# EAGLE design Maze_Project2 (EAGLE 8.7.0)
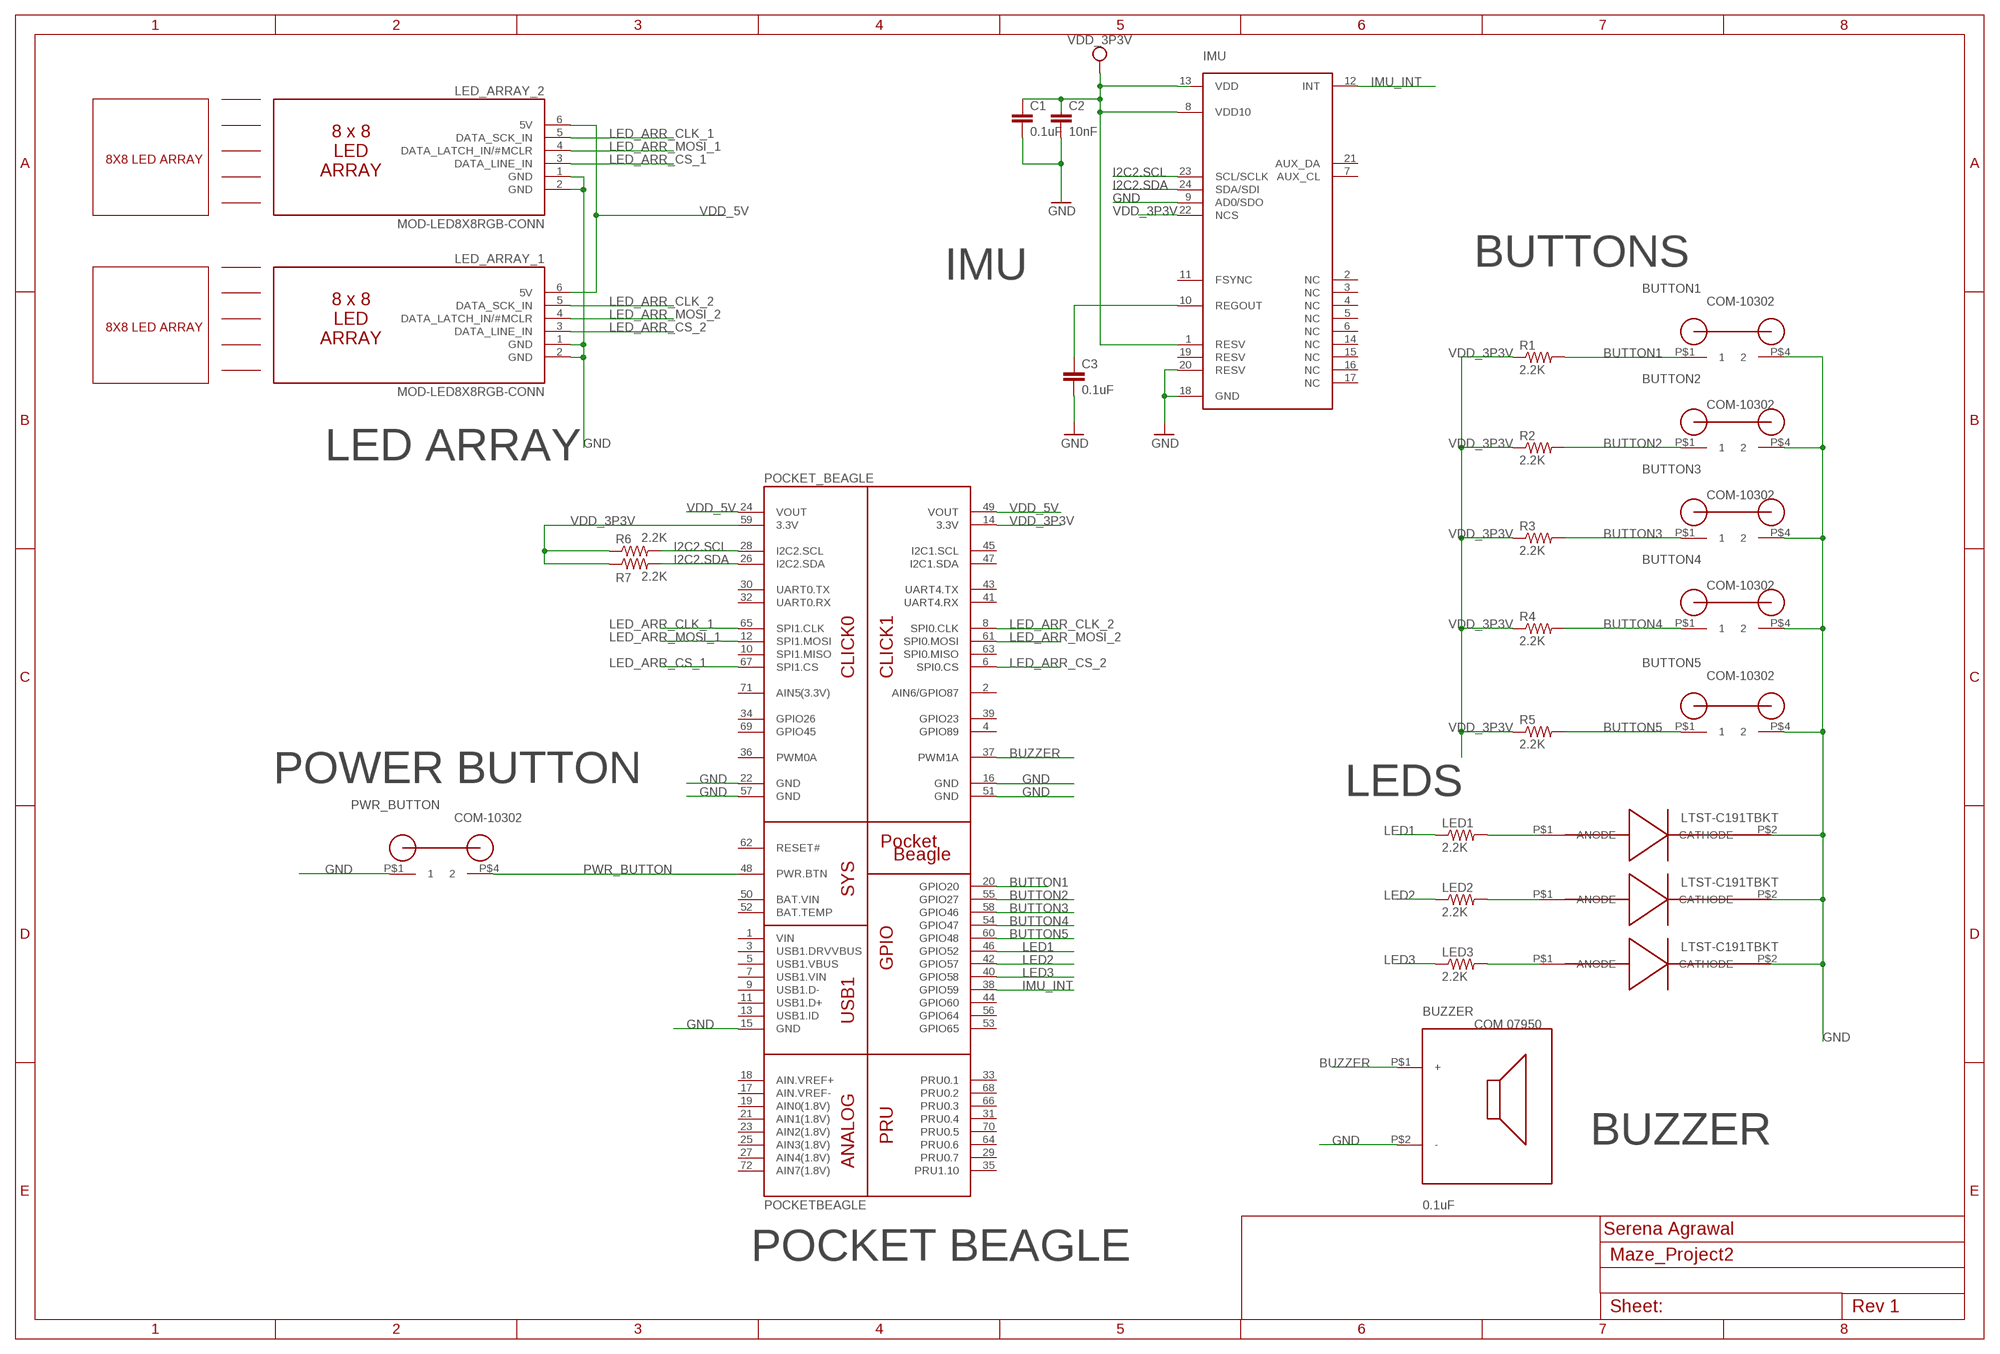
[diagram p0: schematic, sheet 1]

## Parts
BUTTON1  BUTTON  [BUTTON]
BUTTON2  BUTTON  [BUTTON]
BUTTON3  BUTTON  [BUTTON]
BUTTON4  BUTTON  [BUTTON]
BUTTON5  BUTTON  [BUTTON]
BUZZER  0.1uF  BUZZER  [BUZZER]
C1  0.1uF  C_C0402  [C0402]
C2  10nF  C_C0402  [C0402]
C3  0.1uF  C_C0402  [C0402]
IMU  MPU-9250  [QFN-3MMX3MM]
LED1  2.2K  R_R0402  [R0402]
LED2  2.2K  R_R0402  [R0402]
LED3  2.2K  R_R0402  [R0402]
LED_ARRAY_1  MOD-LED8X8RGB-CONN  [FE06W]
LED_ARRAY_2  MOD-LED8X8RGB-CONN  [FE06W]
POCKET_BEAGLE  POCKETBEAGLE  [POCKETBEAGLE]
PWR_BUTTON  BUTTON  [BUTTON]
R1  2.2K  R_R0402  [R0402]
R2  2.2K  R_R0402  [R0402]
R3  2.2K  R_R0402  [R0402]
R4  2.2K  R_R0402  [R0402]
R5  2.2K  R_R0402  [R0402]
R6  2.2K  R_R0402  [R0402]
R7  2.2K  R_R0402  [R0402]
U$7  LED  [LED]
U$8  LED  [LED]
U$9  LED  [LED]

## Nets
B: C3.2 IMU.18(GND) IMU.20(RESV) ; supply symbol labelled GND
BUTTON1: BUTTON1.P$1 POCKET_BEAGLE.20(GPIO20) R1.2
BUTTON2: BUTTON2.P$1 POCKET_BEAGLE.55(GPIO27) R2.2
BUTTON3: BUTTON3.P$1 POCKET_BEAGLE.58(GPIO46) R3.2
BUTTON4: BUTTON4.P$1 POCKET_BEAGLE.54(GPIO47) R4.2
BUTTON5: BUTTON5.P$1 POCKET_BEAGLE.60(GPIO48) R5.2
BUZZER: BUZZER.P$1(+) POCKET_BEAGLE.37(PWM1A)
GND: BUTTON1.P$4 BUTTON2.P$4 BUTTON3.P$4 BUTTON4.P$4 BUTTON5.P$4 BUZZER.P$2(-) IMU.9(AD0/SDO) LED_ARRAY_1.1(GND) LED_ARRAY_1.2(GND) LED_ARRAY_2.1(GND) LED_ARRAY_2.2(GND) POCKET_BEAGLE.15(GND) POCKET_BEAGLE.16(GND) POCKET_BEAGLE.22(GND) POCKET_BEAGLE.51(GND) POCKET_BEAGLE.57(GND) PWR_BUTTON.P$1 U$7.P$2(CATHODE) U$8.P$2(CATHODE) U$9.P$2(CATHODE)
I2C2.SCL: IMU.23(SCL/SCLK) POCKET_BEAGLE.28(I2C2.SCL) R6.2
I2C2.SDA: IMU.24(SDA/SDI) POCKET_BEAGLE.26(I2C2.SDA) R7.2
IMU_INT: IMU.12(INT) POCKET_BEAGLE.38(GPIO59)
LED1: LED1.1 POCKET_BEAGLE.46(GPIO52)
LED2: LED2.1 POCKET_BEAGLE.42(GPIO57)
LED3: LED3.1 POCKET_BEAGLE.40(GPIO58)
LED_ARR_CLK_1: LED_ARRAY_2.5(DATA_SCK_IN) POCKET_BEAGLE.65(SPI1.CLK)
LED_ARR_CLK_2: LED_ARRAY_1.5(DATA_SCK_IN) POCKET_BEAGLE.8(SPI0.CLK)
LED_ARR_CS_1: LED_ARRAY_2.3(DATA_LINE_IN) POCKET_BEAGLE.67(SPI1.CS)
LED_ARR_CS_2: LED_ARRAY_1.3(DATA_LINE_IN) POCKET_BEAGLE.6(SPI0.CS)
LED_ARR_MOSI_1: LED_ARRAY_2.4(DATA_LATCH_IN/#MCLR) POCKET_BEAGLE.12(SPI1.MOSI)
LED_ARR_MOSI_2: LED_ARRAY_1.4(DATA_LATCH_IN/#MCLR) POCKET_BEAGLE.61(SPI0.MOSI)
N$1: C1.2 C2.2 ; supply symbol labelled GND
N$2: C3.1 IMU.10(REGOUT)
N$5: LED1.2 U$7.P$1(ANODE)
N$6: LED2.2 U$8.P$1(ANODE)
N$7: LED3.2 U$9.P$1(ANODE)
PWR_BUTTON: POCKET_BEAGLE.48(PWR.BTN) PWR_BUTTON.P$4
SYS_VDD1_3P3V: C1.1 C2.1 IMU.1(RESV) IMU.8(VDD10) IMU.13(VDD) ; supply symbol labelled VDD_3P3V
VDD_3P3V: IMU.22(NCS) POCKET_BEAGLE.14(3.3V) POCKET_BEAGLE.59(3.3V) R1.1 R2.1 R3.1 R4.1 R5.1 R6.1 R7.1
VDD_5V: LED_ARRAY_1.6(5V) LED_ARRAY_2.6(5V) POCKET_BEAGLE.24(VOUT) POCKET_BEAGLE.49(VOUT)
Unconnected: IMU.2(NC) IMU.3(NC) IMU.4(NC) IMU.5(NC) IMU.6(NC) IMU.7(AUX_CL) IMU.11(FSYNC) IMU.14(NC) IMU.15(NC) IMU.16(NC) IMU.17(NC) IMU.19(RESV) IMU.21(AUX_DA) POCKET_BEAGLE.1(VIN) POCKET_BEAGLE.2(AIN6/GPIO87) POCKET_BEAGLE.3(USB1.DRVVBUS) POCKET_BEAGLE.4(GPIO89) POCKET_BEAGLE.5(USB1.VBUS) POCKET_BEAGLE.7(USB1.VIN) POCKET_BEAGLE.9(USB1.D-) POCKET_BEAGLE.10(SPI1.MISO) POCKET_BEAGLE.11(USB1.D+) POCKET_BEAGLE.13(USB1.ID) POCKET_BEAGLE.17(AIN.VREF-) POCKET_BEAGLE.18(AIN.VREF+) POCKET_BEAGLE.19(AIN0(1.8V)) POCKET_BEAGLE.21(AIN1(1.8V)) POCKET_BEAGLE.23(AIN2(1.8V)) POCKET_BEAGLE.25(AIN3(1.8V)) POCKET_BEAGLE.27(AIN4(1.8V)) POCKET_BEAGLE.29(PRU0.7) POCKET_BEAGLE.30(UART0.TX) POCKET_BEAGLE.31(PRU0.4) POCKET_BEAGLE.32(UART0.RX) POCKET_BEAGLE.33(PRU0.1) POCKET_BEAGLE.34(GPIO26) POCKET_BEAGLE.35(PRU1.10) POCKET_BEAGLE.36(PWM0A) POCKET_BEAGLE.39(GPIO23) POCKET_BEAGLE.41(UART4.RX) POCKET_BEAGLE.43(UART4.TX) POCKET_BEAGLE.44(GPIO60) POCKET_BEAGLE.45(I2C1.SCL) POCKET_BEAGLE.47(I2C1.SDA) POCKET_BEAGLE.50(BAT.VIN) POCKET_BEAGLE.52(BAT.TEMP) POCKET_BEAGLE.53(GPIO65) POCKET_BEAGLE.56(GPIO64) POCKET_BEAGLE.62(RESET#) POCKET_BEAGLE.63(SPI0.MISO) POCKET_BEAGLE.64(PRU0.6) POCKET_BEAGLE.66(PRU0.3) POCKET_BEAGLE.68(PRU0.2) POCKET_BEAGLE.69(GPIO45) POCKET_BEAGLE.70(PRU0.5) POCKET_BEAGLE.71(AIN5(3.3V)) POCKET_BEAGLE.72(AIN7(1.8V))

## Notes on the sheet
- 8X8 LED ARRAY
- IMU | BUTTONS
- COM-10302
- 8X8 LED ARRAY
- COM-10302
- LED ARRAY
- COM-10302
- COM-10302
- COM-10302
- POWER BUTTON | LEDS
- COM-10302 | LTST-C191TBKT
- LTST-C191TBKT
- LTST-C191TBKT
- COM 07950
- BUZZER
- Serena Agrawal
- POCKET BEAGLE

## Library data of the parts
BUTTON1-BUTTON5 PWR_BUTTON = ENGI_301_Maze:BUTTON
BUZZER = ENGI_301_Maze:BUZZER
C1-C3 = ENGI301_PCB_design_project:C_: Capacitor SMD. Sizes: 0402, 0603 & 0805
IMU = ENGI301_PCB_design_project:MPU-9250
LED1-LED3 R1-R7 = ENGI301_design_example:R_: RESISTOR, American symbol
LED_ARRAY_1 LED_ARRAY_2 = ENGI301_Maze_Project_Parts (1):MOD-LED8X8RGB-CONN
POCKET_BEAGLE = ENGI301_Maze_Project_Parts:POCKETBEAGLE
U$7-U$9 = ENGI_301_Maze:LED

## Board
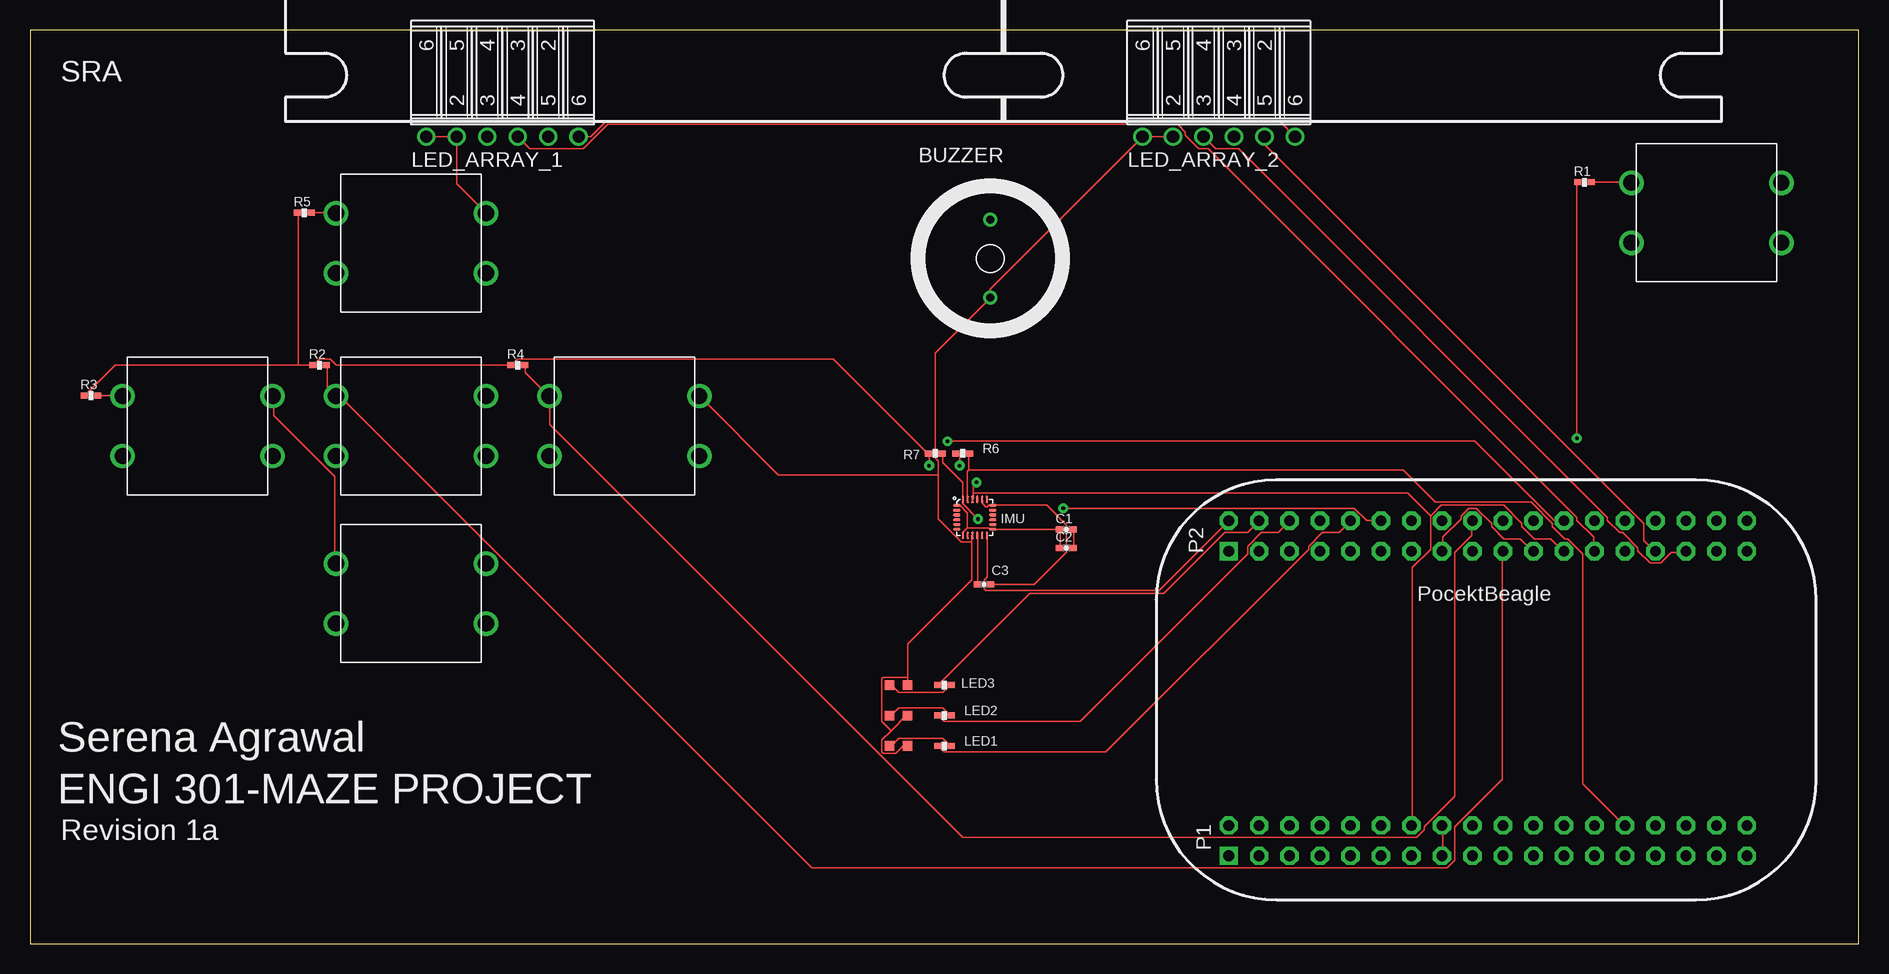
[diagram p1: board, top side]
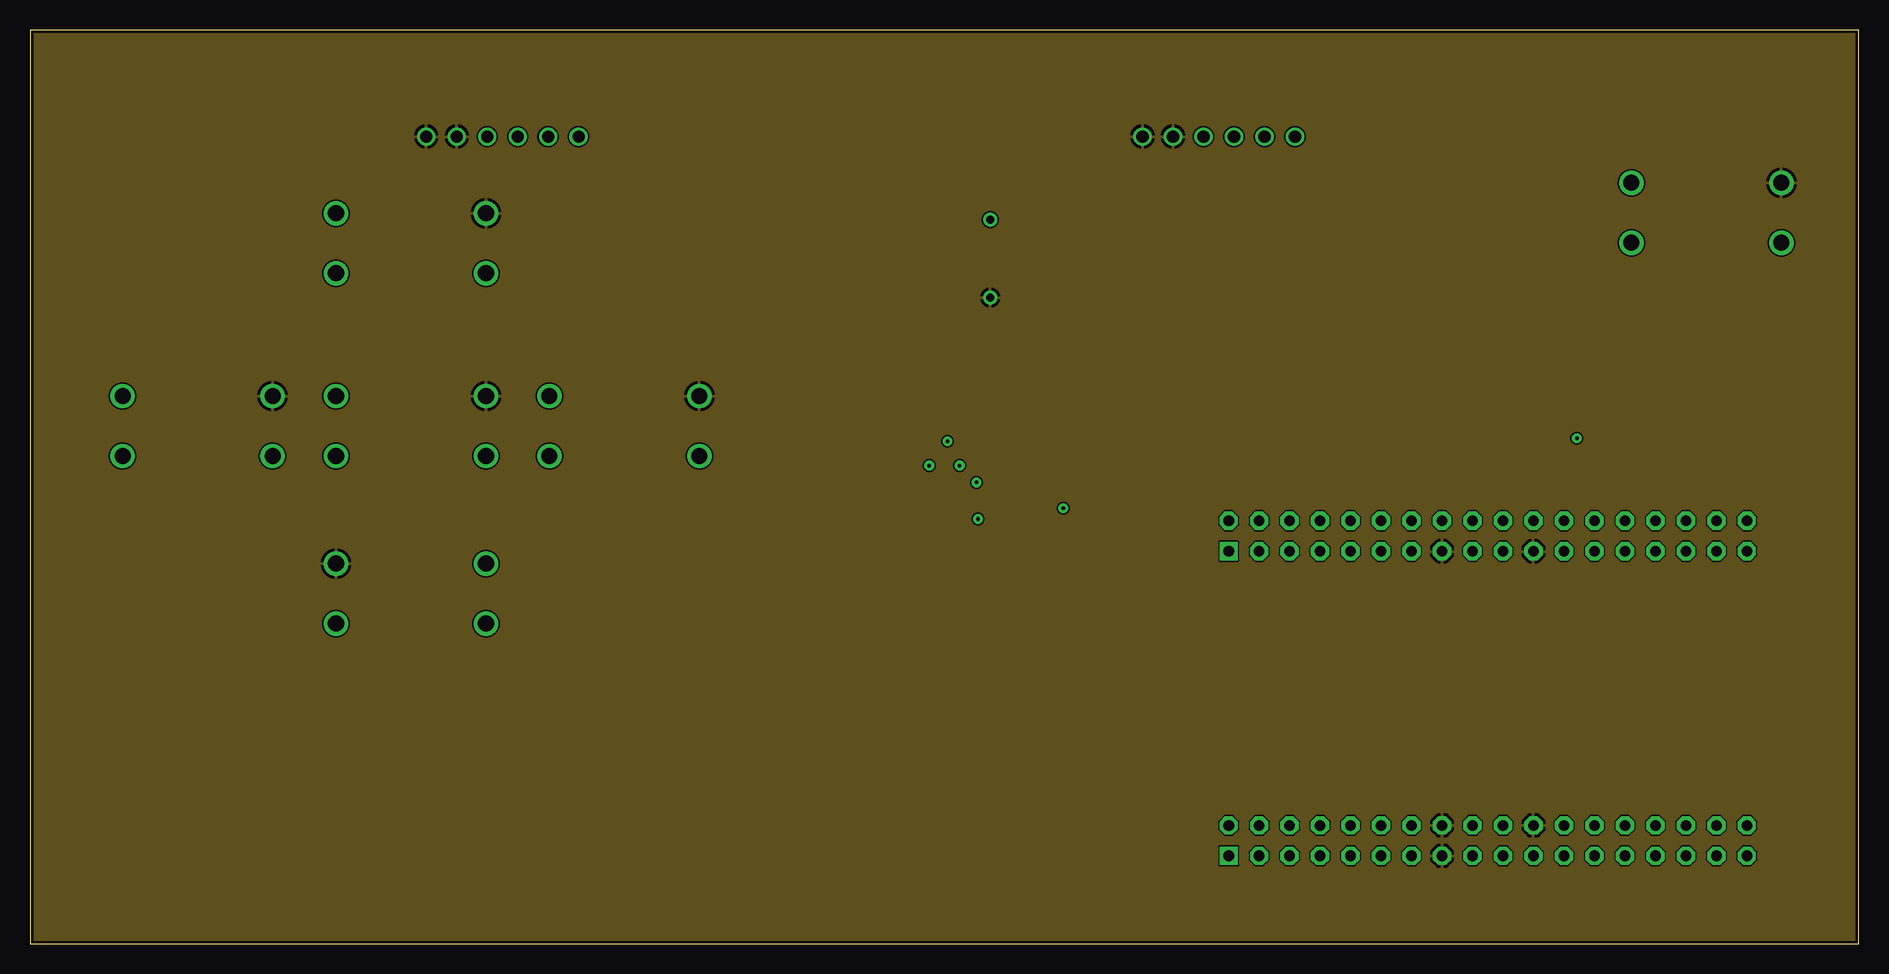
[diagram p2: board, inner layer Route2]
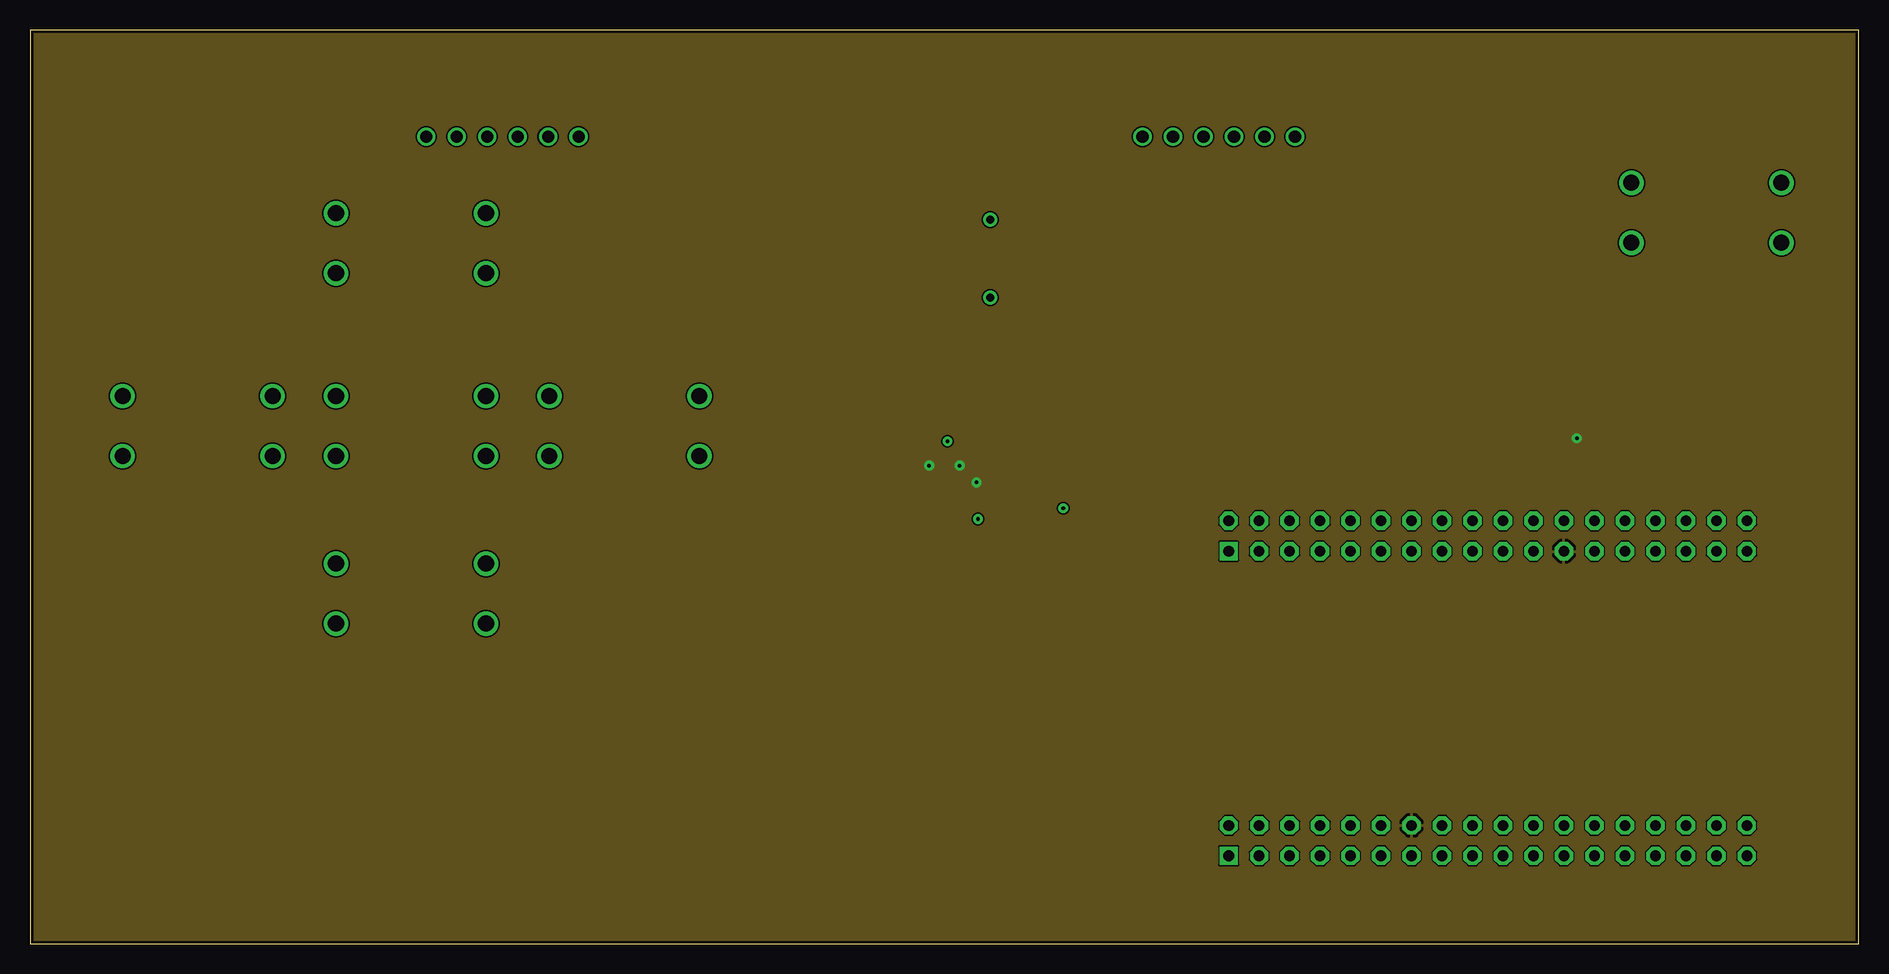
[diagram p3: board, inner layer Route15]
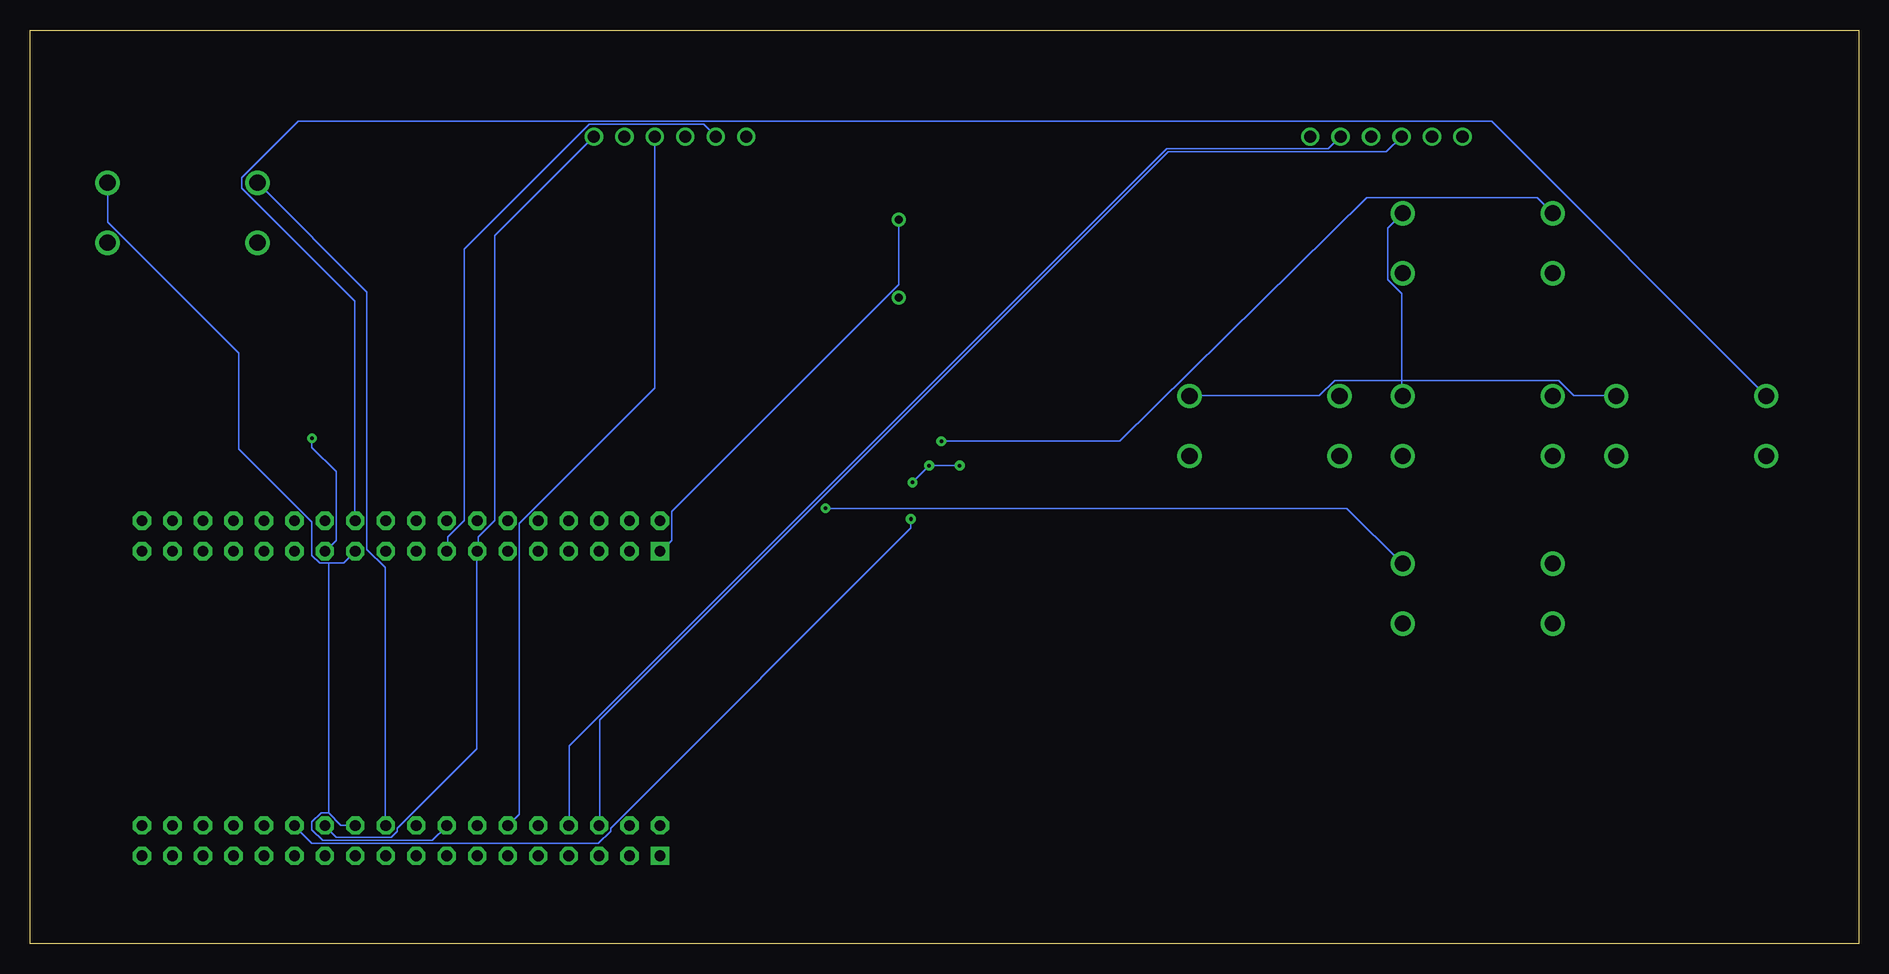
[diagram p4: board, bottom side, seen from below]

Size 152.4 x 76.2 mm. Coordinates in mm from the lower left corner, seen from the top.
Outline: 0,0 152.4,0 152.4,76.2 0,76.2 0,0
Copper layers (1*2*15*16): Top 0.035mm / dielectric 0.23mm / Route2 0.035mm / dielectric 0.93mm / Route15 0.035mm / dielectric 0.23mm / Bottom 0.035mm
Design rules "ENGI301_Maze_Project_4lyr *": minimum track width 5mil, minimum drill 12mil, track to track 5mil, track to pad 5mil, pad to pad 5mil, via to via 10mil, smd to smd 10mil, copper to edge 10mil, drill to drill 12mil, minimum pad ring 10mil, minimum via ring 10mil, stop-mask expansion 3mil, vias tented up to drill 25mil, thermal gap 10mil

### Footprints (pad centres in the part's own frame; a part is rotated, then mirrored left to right if it is on the bottom)
BUTTON = drill 1.35: P$1 -6.25,2.5; P$2 -6.25,-2.5; P$3 6.25,-2.5; P$4 6.25,2.5
BUZZER = drill 0.65: P$1 0,3.25; P$2 0,-3.25
C0402 = smd 0.61 x 0.508: 1 -0.559,0; 2 0.559,0
QFN-3MMX3MM = smd 0.6 x 0.2: 1 -1.5,1; 2 -1.5,0.6; 3 -1.5,0.2; 4 -1.5,-0.2; 5 -1.5,-0.6; 6 -1.5,-1; 13 1.5,-1; 14 1.5,-0.6; 15 1.5,-0.2; 16 1.5,0.2; 17 1.5,0.6; 18 1.5,1 | smd 0.2 x 0.6: 7 -0.6,-1.5; 8 -1,-1.5; 9 -0.2,-1.5; 10 0.2,-1.5; 11 0.6,-1.5; 12 1,-1.5; 19 1,1.5; 20 0.6,1.5; 21 0.2,1.5; 22 -0.2,1.5; 23 -0.6,1.5; 24 -1,1.5
R0402 = smd 0.61 x 0.508: 1 -0.559,0; 2 0.559,0
FE06W = drill 1.016: 1 -6.35,0; 2 -3.81,0; 3 -1.27,0; 4 1.27,0; 5 3.81,0; 6 6.35,0
POCKETBEAGLE = drill 0.889 pad 1.524 square: 1 5.91,3.53; 37 5.91,28.93 | drill 0.889 pad 1.524 octagon: 2 5.91,6.07; 3 8.45,3.53; 4 8.45,6.07; 5 10.99,3.53; 6 10.99,6.07; 7 13.53,3.53; 8 13.53,6.07; 9 16.07,3.53; 10 16.07,6.07; 11 18.61,3.53; 12 18.61,6.07; 13 21.15,3.53; 14 21.15,6.07; 15 23.69,3.53; 16 23.69,6.07; 17 26.23,3.53; 18 26.23,6.07; 19 28.77,3.53; 20 28.77,6.07; 21 31.31,3.53; 22 31.31,6.07; 23 33.85,3.53; 24 33.85,6.07; 25 36.39,3.53; 26 36.39,6.07; 27 38.93,3.53; 28 38.93,6.07; 29 41.47,3.53; 30 41.47,6.07; 31 44.01,3.53; 32 44.01,6.07; 33 46.55,3.53; 34 46.55,6.07; 35 49.09,3.53; 36 49.09,6.07; 38 5.91,31.47; 39 8.45,28.93; 40 8.45,31.47; 41 10.99,28.93; 42 10.99,31.47; 43 13.53,28.93; 44 13.53,31.47; 45 16.07,28.93; 46 16.07,31.47; 47 18.61,28.93; 48 18.61,31.47; 49 21.15,28.93; 50 21.15,31.47; 51 23.69,28.93; 52 23.69,31.47; 53 26.23,28.93; 54 26.23,31.47; 55 28.77,28.93; 56 28.77,31.47; 57 31.31,28.93; 58 31.31,31.47; 59 33.85,28.93; 60 33.85,31.47; 61 36.39,28.93; 62 36.39,31.47; 63 38.93,28.93; 64 38.93,31.47; 65 41.47,28.93; 66 41.47,31.47; 67 44.01,28.93; 68 44.01,31.47; 69 46.55,28.93; 70 46.55,31.47; 71 49.09,28.93; 72 49.09,31.47
LED = smd 0.8 x 0.8: P$1 -0.75,0; P$2 0.75,0

### Placement (x,y rotation side)
BUTTON1  139.7,60.96 0 top
BUTTON2  31.75,43.18 0 top
BUTTON3  13.97,43.18 0 top
BUTTON4  49.53,43.18 0 top
BUTTON5  31.75,58.42 0 top
BUZZER  80.01,57.15 0 top
C1  86.36,34.54 0 top
C2  86.36,33.02 0 top
C3  79.5,29.97 0 top
IMU  78.74,35.56 0 top
LED1  76.2,16.51 0 top
LED2  76.2,19.05 0 top
LED3  76.2,21.59 0 top
LED_ARRAY_1  39.37,67.31 0 top
LED_ARRAY_2  99.06,67.31 0 top
POCKET_BEAGLE  93.98,3.81 0 top
PWR_BUTTON  31.75,29.21 0 top
R1  129.54,63.5 0 top
R2  24.13,48.26 0 top
R3  5.08,45.72 0 top
R4  40.64,48.26 0 top
R5  22.86,60.96 0 top
R6  77.72,40.89 0 top
R7  75.44,40.89 0 top
U$1  [MOD-LED8X8RGB]  81.28,68.58 90 top
U$2  [MOD-LED8X8RGB]  140.97,68.58 90 top
U$3  [MOD-LED8X8RGB]  140.97,127 90 top  (outside the outline)
U$4  [MOD-LED8X8RGB]  81.28,127 90 top  (outside the outline)
U$7  72.39,16.51 0 top
U$8  72.39,19.05 0 top
U$9  72.39,21.59 0 top

### Tracks (layer width: path | path; a pad name or v marks a point on that pad's centre or on a via)
B
  Top 0.127: IMU.20 79.38,36.96 79.38,36.7 79.63,36.45 79.76,36.45 79.88,36.58 80.14,36.58 IMU.18 80.26,36.58 84.71,36.58 86.36,34.92 86.36,32.64 83.69,29.97 C3.2
BUTTON1
  Top 0.127: R1.2 133.35,63.5 BUTTON1.P$1
  Bottom 0.127: POCKET_BEAGLE.20 122.81,9.91 122.81,31.37 124.33,32.89 124.33,54.36 133.35,63.37 BUTTON1.P$1
BUTTON2
  Top 0.127: R2.2 24.77,48.26 24.77,46.35 25.4,45.72 BUTTON2.P$1 25.53,45.59 25.91,45.59 65.15,6.35 118.11,6.35 118.75,6.99 118.75,9.78 122.68,13.72 122.68,32.64 POCKET_BEAGLE.55
BUTTON3
  Top 0.127: R3.2 7.62,45.72 BUTTON3.P$1
  Bottom 0.127: POCKET_BEAGLE.58 125.35,35.31 125.35,53.59 134.75,62.99 134.75,63.88 130.05,68.58 30.61,68.58 7.75,45.72 BUTTON3.P$1
BUTTON4
  Top 0.127: R4.2 41.27,48.26 41.27,47.62 43.18,45.72 BUTTON4.P$1 43.31,45.59 43.31,43.31 77.72,8.89 115.57,8.89 116.2,9.53 116.2,9.78 118.75,12.32 118.75,32.64 120.14,34.04 120.14,35.18 POCKET_BEAGLE.54
BUTTON5  (via drill 0.3)
  Top 0.127: R5.2 25.4,60.96 BUTTON5.P$1 | v76.45,41.91 120.4,41.91 127,35.31 127.76,35.31 POCKET_BEAGLE.60
  Bottom 0.127: v76.45,41.91 61.59,41.91 41.02,62.23 26.8,62.23 25.53,60.96 BUTTON5.P$1
BUZZER
  Bottom 0.127: BUZZER.P$1 80.01,54.99 98.93,36.07 98.93,33.66 99.82,32.77 POCKET_BEAGLE.37
GND
  Top 0.127: POCKET_BEAGLE.15 117.73,7.37 117.73,9.78 POCKET_BEAGLE.16 | POCKET_BEAGLE.51 117.73,32.77 117.73,33.91 119.25,35.43 119.25,35.69 119.89,36.32 120.52,36.32 121.79,35.05 121.79,34.8 122.81,33.78 124.21,33.78 125.22,32.77 POCKET_BEAGLE.57 | U$7.P$2 72.77,16.51 72.14,15.88 71.12,15.88 70.99,16 70.99,17.02 71.75,17.78 | 71.75,17.78 73.03,19.05 U$8.P$2 | 78.49,33.53 78.49,30.35 73.15,25.02 73.15,22.23 | 78.49,33.53 78.49,34.04 IMU.9 | 73.15,22.23 73.15,21.59 U$9.P$2 | 71.75,17.78 70.99,18.54 70.99,22.1 71.12,22.23 73.15,22.23 | LED_ARRAY_2.2 LED_ARRAY_2.1 80.01,54.61 BUZZER.P$2 80.01,53.85 75.44,49.28 75.44,40.51 75.69,40.26 75.69,39.12 | 78.49,33.53 77.6,33.53 75.69,35.43 75.69,39.12 | PWR_BUTTON.P$1 25.4,31.75 25.4,38.99 20.32,44.07 20.32,45.59 BUTTON3.P$4 | LED_ARRAY_1.1 LED_ARRAY_1.2 35.56,63.37 37.97,60.96 BUTTON5.P$4 | 75.69,39.12 62.36,39.12 55.88,45.59 BUTTON4.P$4
  Bottom 0.127: 127.51,10.92 126.49,9.91 125.35,9.91 POCKET_BEAGLE.22 | 127.51,10.92 128.14,10.92 128.91,10.16 128.91,9.53 128.02,8.64 118.87,8.64 117.73,9.78 POCKET_BEAGLE.16 | 127.51,31.75 126.24,31.75 125.35,32.64 POCKET_BEAGLE.57 | 127.51,31.75 128.27,31.75 128.91,32.38 128.91,35.18 135,41.27 135,49.28 145.92,60.2 145.92,63.37 BUTTON1.P$4 | 127.51,31.75 127.51,10.92 | 38.1,46.99 38.1,54.23 39.24,55.37 39.24,59.69 38.1,60.83 BUTTON5.P$4 | 38.1,46.99 38.1,45.72 BUTTON2.P$4 | 38.1,46.99 43.69,46.99 44.96,45.72 55.75,45.72 BUTTON4.P$4 | 38.1,46.99 25.02,46.99 23.75,45.72 20.32,45.72 BUTTON3.P$4 | LED_ARRAY_2.2 96.27,68.33 105.79,68.33 116.2,57.91 116.2,35.31 117.6,33.91 117.6,32.77 POCKET_BEAGLE.51
  pour Route2: -1.27,-1.27 -1.27,77.47 153.67,77.47 153.67,-1.27
I2C2.SCL
  Top 0.127: 78.23,39.5 78.11,39.37 78.11,37.08 IMU.23 | 78.23,39.5 78.23,40.89 R6.2 | 78.23,39.5 114.43,39.5 117.09,36.83 125.09,36.83 126.87,35.05 126.87,34.8 127.89,33.78 128.14,33.78 129.41,32.51 129.41,13.34 132.84,9.91 POCKET_BEAGLE.28
I2C2.SDA  (via drill 0.3)
  Top 0.127: R7.2 76.07,40.89 76.07,40.13 77.72,38.48 77.72,37.08 IMU.24 77.72,36.96 77.72,36.7 v78.99,35.43
  Bottom 0.127: v78.99,35.43 78.99,34.67 104.01,9.65 104.01,9.4 105.03,8.38 128.91,8.38 130.3,9.78 POCKET_BEAGLE.26
IMU_INT
  Top 0.127: IMU.12 79.76,34.04 79.76,30.61 79.5,30.35 79.5,29.59 79.63,29.46 94.11,29.46 99.82,35.18 POCKET_BEAGLE.38
LED1
  Top 0.127: LED1.1 75.69,16.51 76.2,16 89.66,16 106.55,32.89 106.55,33.15 107.7,34.29 109.09,34.29 109.98,35.18 POCKET_BEAGLE.46
LED2
  Top 0.127: LED2.1 75.69,19.05 76.2,18.54 87.5,18.54 101.47,32.51 101.47,33.15 102.62,34.29 104.01,34.29 104.9,35.18 POCKET_BEAGLE.42
LED3
  Top 0.127: LED3.1 75.69,21.59 83.31,29.21 94.49,29.21 99.57,34.29 101.47,34.29 102.36,35.18 POCKET_BEAGLE.40
LED_ARR_CLK_1
  Top 0.127: LED_ARRAY_2.5 102.87,66.67 134.49,35.05 134.49,33.66 135.38,32.77 POCKET_BEAGLE.65
LED_ARR_CLK_2
  Bottom 0.127: LED_ARRAY_1.5 44.2,66.29 57.66,66.29 107.44,16.51 107.44,9.91 POCKET_BEAGLE.8
LED_ARR_CS_1
  Top 0.127: LED_ARRAY_2.3 98.81,66.29 100.71,66.29 131.44,35.56 131.44,35.31 132.46,34.29 132.72,34.29 133.99,33.02 133.99,32.77 135,31.75 135.89,31.75 136.78,32.64 137.92,32.64 POCKET_BEAGLE.67
LED_ARR_CS_2
  Bottom 0.127: LED_ARRAY_1.3 39.37,66.04 57.53,66.04 104.9,18.67 104.9,9.91 POCKET_BEAGLE.6
LED_ARR_MOSI_1
  Bottom 0.127: LED_ARRAY_2.4 100.33,46.35 111.63,35.05 111.63,10.79 112.52,9.91 POCKET_BEAGLE.12
LED_ARR_MOSI_2
  Top 0.127: LED_ARRAY_1.4 41.66,66.29 46.1,66.29 48.13,68.33 95.63,68.33 96.27,67.69 96.27,67.44 97.41,66.29 98.17,66.29 128.91,35.56 128.91,35.31 130.3,33.91 130.3,32.77 POCKET_BEAGLE.61
N$1
  Top 0.127: C2.2 87,33.02 87,34.54 C1.2
N$2
  Top 0.127: IMU.10 78.99,34.04 78.99,29.97 C3.1
N$5
  Top 0.127: LED1.2 76.71,16.51 76.07,17.14 72.39,17.14 71.75,16.51 U$7.P$1
N$6
  Top 0.127: LED2.2 76.71,19.05 76.07,19.68 72.39,19.68 71.75,19.05 U$8.P$1
N$7
  Top 0.127: LED3.2 76.71,21.59 76.07,20.95 72.39,20.95 71.75,21.59 U$9.P$1
PWR_BUTTON  (via drill 0.3)
  Top 0.127: v86.11,36.32 110.36,36.32 111.38,35.31 112.52,35.31 POCKET_BEAGLE.48
  Bottom 0.127: v86.11,36.32 42.67,36.32 38.1,31.75 PWR_BUTTON.P$4
SYS_VDD1_3P3V
  Top 0.127: C2.1 85.85,33.02 85.85,34.54 C1.1 80.26,34.54 IMU.13 80.14,34.54 80.01,34.54 79.88,34.67 78.11,34.67 | 78.11,34.67 77.72,34.29 77.72,34.16 IMU.8 | 78.11,34.67 78.11,35.94 77.47,36.58 77.34,36.58 IMU.1
VDD_3P3V  (via drill 0.3)
  Top 0.127: 22.35,48.26 R2.1 23.62,48.26 24.13,48.77 25.02,48.77 25.53,48.26 R4.1 40.13,48.26 40.64,48.77 66.93,48.77 74.8,40.89 R7.1 74.93,40.89 v74.93,39.88 | 22.35,48.26 7.11,48.26 4.57,45.72 R3.1 | 22.35,48.26 22.35,60.96 R5.1 | 78.61,37.59 78.61,38.23 v78.87,38.48 | 78.61,37.59 78.61,37.08 IMU.22 | v77.47,39.88 77.47,40.64 77.22,40.89 R6.1 | v128.91,42.16 128.91,63.5 R1.1 | 116.71,35.69 116.71,32.89 115.19,31.37 115.19,9.91 POCKET_BEAGLE.14 | 116.71,35.69 117.6,36.58 122.81,36.58 124.33,35.05 124.33,34.8 125.35,33.78 126.75,33.78 127.76,32.77 POCKET_BEAGLE.59 | 78.61,37.59 114.81,37.59 116.71,35.69
  Bottom 0.127: v78.87,38.48 v77.47,39.88 v74.93,39.88 | v128.91,42.16 128.91,41.4 126.87,39.37 126.87,33.66 127.76,32.77 POCKET_BEAGLE.59
  pour Route15: -2.54,-2.54 -2.54,78.74 154.94,78.74 154.94,-2.54
VDD_5V
  Top 0.127: LED_ARRAY_1.6 46.74,67.31 48.01,68.58 104.14,68.58 LED_ARRAY_2.6
  Bottom 0.127: POCKET_BEAGLE.24 127.76,9.78 126.87,8.89 122.3,8.89 121.79,9.4 121.79,9.65 115.19,16.26 115.19,32.64 POCKET_BEAGLE.49 115.06,32.77 115.06,33.91 113.67,35.31 113.67,59.05 LED_ARRAY_2.6

### Text on the board
tSilk: SRA | Serena Agrawal | ENGI 301-MAZE PROJECT | Revision 1a